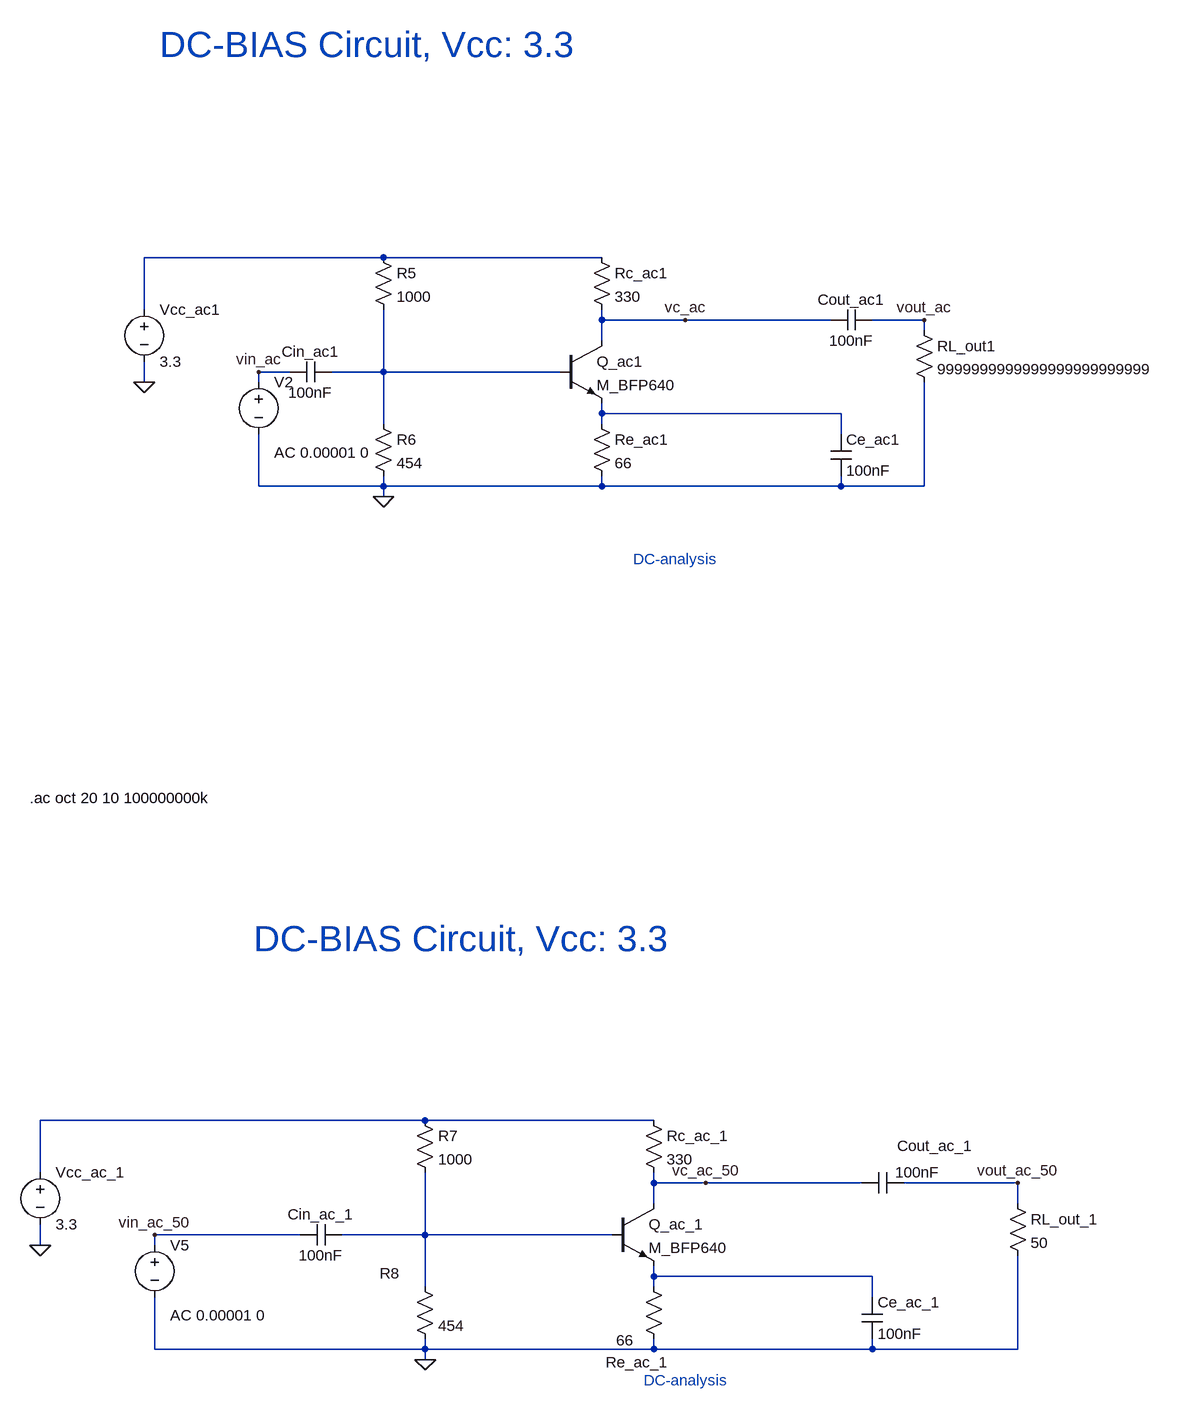
[diagram p0: schematic BP640_FREQ.asc]
BP640_FREQ.asc, the LTspice schematic file:
Version 4
SHEET 1 2084 1136
WIRE -2048 -608 -2416 -608
WIRE -1712 -608 -2048 -608
WIRE -2416 -528 -2416 -608
WIRE -1712 -512 -1712 -528
WIRE -1584 -512 -1712 -512
WIRE -1360 -512 -1584 -512
WIRE -1216 -512 -1296 -512
WIRE -1216 -496 -1216 -512
WIRE -1712 -480 -1712 -512
WIRE -2192 -432 -2240 -432
WIRE -2048 -432 -2048 -528
WIRE -2048 -432 -2128 -432
WIRE -1776 -432 -2048 -432
WIRE -2416 -416 -2416 -448
WIRE -2240 -416 -2240 -432
WIRE -1712 -368 -1712 -384
WIRE -1344 -368 -1712 -368
WIRE -2048 -352 -2048 -432
WIRE -1712 -352 -1712 -368
WIRE -1344 -336 -1344 -368
WIRE -2240 -256 -2240 -336
WIRE -2048 -256 -2048 -272
WIRE -2048 -256 -2240 -256
WIRE -1712 -256 -1712 -272
WIRE -1712 -256 -2048 -256
WIRE -1344 -256 -1344 -272
WIRE -1344 -256 -1712 -256
WIRE -1216 -256 -1216 -416
WIRE -1216 -256 -1344 -256
WIRE -2048 -240 -2048 -256
WIRE -1984 720 -2576 720
WIRE -1632 720 -1984 720
WIRE -2576 800 -2576 720
WIRE -1632 816 -1632 800
WIRE -1552 816 -1632 816
WIRE -1312 816 -1552 816
WIRE -1072 816 -1248 816
WIRE -1632 848 -1632 816
WIRE -1072 848 -1072 816
WIRE -2176 896 -2400 896
WIRE -1984 896 -1984 800
WIRE -1984 896 -2112 896
WIRE -1696 896 -1984 896
WIRE -2576 912 -2576 880
WIRE -2400 912 -2400 896
WIRE -1632 960 -1632 944
WIRE -1296 960 -1632 960
WIRE -1984 976 -1984 896
WIRE -1632 976 -1632 960
WIRE -1296 992 -1296 960
WIRE -2400 1072 -2400 992
WIRE -1984 1072 -1984 1056
WIRE -1984 1072 -2400 1072
WIRE -1632 1072 -1632 1056
WIRE -1632 1072 -1984 1072
WIRE -1296 1072 -1296 1056
WIRE -1296 1072 -1632 1072
WIRE -1072 1072 -1072 928
WIRE -1072 1072 -1296 1072
WIRE -1984 1088 -1984 1072
FLAG -2416 -416 0
FLAG -2048 -240 0
FLAG -2576 912 0
FLAG -1984 1088 0
FLAG -2400 896 vin_ac_50
FLAG -1072 816 vout_ac_50
FLAG -2240 -432 vin_ac
FLAG -1216 -512 vout_ac
FLAG -1584 -512 vc_ac
FLAG -1552 816 vc_ac_50
DATAFLAG -1632 816 ""
DATAFLAG -1632 832 ""
SYMBOL voltage -2240 -432 R0
WINDOW 123 24 124 Left 2
WINDOW 39 0 0 Left 0
SYMATTR Value2 AC 0.00001 0
SYMATTR InstName V2
SYMATTR Value ""
SYMBOL voltage -2416 -544 R0
WINDOW 123 0 0 Left 0
WINDOW 39 0 0 Left 0
SYMATTR InstName Vcc_ac1
SYMATTR Value 3.3
SYMBOL npn -1776 -480 R0
SYMATTR InstName Q_ac1
SYMATTR Value M_BFP640
SYMBOL res -2064 -624 R0
SYMATTR InstName R5
SYMATTR Value 1000
SYMBOL res -2064 -368 R0
SYMATTR InstName R6
SYMATTR Value 454
SYMBOL res -1728 -368 R0
SYMATTR InstName Re_ac1
SYMATTR Value 66
SYMBOL res -1728 -624 R0
SYMATTR InstName Rc_ac1
SYMATTR Value 330
SYMBOL res -1232 -512 R0
SYMATTR InstName RL_out1
SYMATTR Value 9999999999999999999999999
SYMBOL cap -1360 -336 R0
SYMATTR InstName Ce_ac1
SYMATTR Value 100nF
SYMBOL cap -1296 -528 R90
WINDOW 0 0 32 VBottom 2
WINDOW 3 32 32 VTop 2
SYMATTR InstName Cout_ac1
SYMATTR Value 100nF
SYMBOL cap -2128 -448 R90
WINDOW 0 0 32 VBottom 2
WINDOW 3 32 32 VTop 2
SYMATTR InstName Cin_ac1
SYMATTR Value 100nF
SYMBOL voltage -2576 784 R0
WINDOW 123 0 0 Left 0
WINDOW 39 0 0 Left 0
SYMATTR InstName Vcc_ac_1
SYMATTR Value 3.3
SYMBOL npn -1696 848 R0
SYMATTR InstName Q_ac_1
SYMATTR Value M_BFP640
SYMBOL res -2000 704 R0
SYMATTR InstName R7
SYMATTR Value 1000
SYMBOL res -2000 960 R0
WINDOW 0 -54 -5 Left 2
SYMATTR InstName R8
SYMATTR Value 454
SYMBOL res -1648 960 R0
WINDOW 0 -58 132 Left 2
WINDOW 3 -42 98 Left 2
SYMATTR InstName Re_ac_1
SYMATTR Value 66
SYMBOL res -1648 704 R0
SYMATTR InstName Rc_ac_1
SYMATTR Value 330
SYMBOL res -1088 832 R0
SYMATTR InstName RL_out_1
SYMATTR Value 50
SYMBOL cap -1312 992 R0
SYMATTR InstName Ce_ac_1
SYMATTR Value 100nF
SYMBOL cap -1248 800 R90
WINDOW 0 -25 -49 VBottom 2
WINDOW 3 -16 -22 VTop 2
SYMATTR InstName Cout_ac_1
SYMATTR Value 100nF
SYMBOL cap -2112 880 R90
WINDOW 0 0 32 VBottom 2
WINDOW 3 32 32 VTop 2
SYMATTR InstName Cin_ac_1
SYMATTR Value 100nF
SYMBOL voltage -2400 896 R0
WINDOW 123 24 124 Left 2
WINDOW 39 0 0 Left 0
SYMATTR Value2 AC 0.00001 0
SYMATTR InstName V5
SYMATTR Value ""
TEXT -1664 -144 Left 2 ;DC-analysis
TEXT -2392 -936 Left 5 ;DC-BIAS Circuit, Vcc: 3.3
TEXT -1648 1120 Left 2 ;DC-analysis
TEXT -2248 440 Left 5 ;DC-BIAS Circuit, Vcc: 3.3
TEXT -2592 224 Left 2 !.ac oct 20 10 100000000k

The netlist it stands for:
* BP640_FREQ.asc
V2 vin_ac 0 AC 0.00001 0
Vcc_ac1 N001 0 3.3
Q_ac1 vc_ac N002 N003 0 M_BFP640
R5 N001 N002 1000
R6 N002 0 454
Re_ac1 N003 0 66
Rc_ac1 N001 vc_ac 330
RL_out1 vout_ac 0 9999999999999999999999999
Ce_ac1 N003 0 100nF
Cout_ac1 vout_ac vc_ac 100nF
Cin_ac1 N002 vin_ac 100nF
Vcc_ac_1 N004 0 3.3
Q_ac_1 vc_ac_50 N005 N006 0 M_BFP640
R7 N004 N005 1000
R8 N005 0 454
Re_ac_1 N006 0 66
Rc_ac_1 N004 vc_ac_50 330
RL_out_1 vout_ac_50 0 50
Ce_ac_1 N006 0 100nF
Cout_ac_1 vout_ac_50 vc_ac_50 100nF
Cin_ac_1 N005 vin_ac_50 100nF
V5 vin_ac_50 0 AC 0.00001 0
.model NPN NPN
.model PNP PNP
.lib standard.bjt
* DC-analysis
* DC-BIAS Circuit, Vcc: 3.3
* DC-analysis
* DC-BIAS Circuit, Vcc: 3.3
.ac oct 20 10 100000000k
.backanno
.end